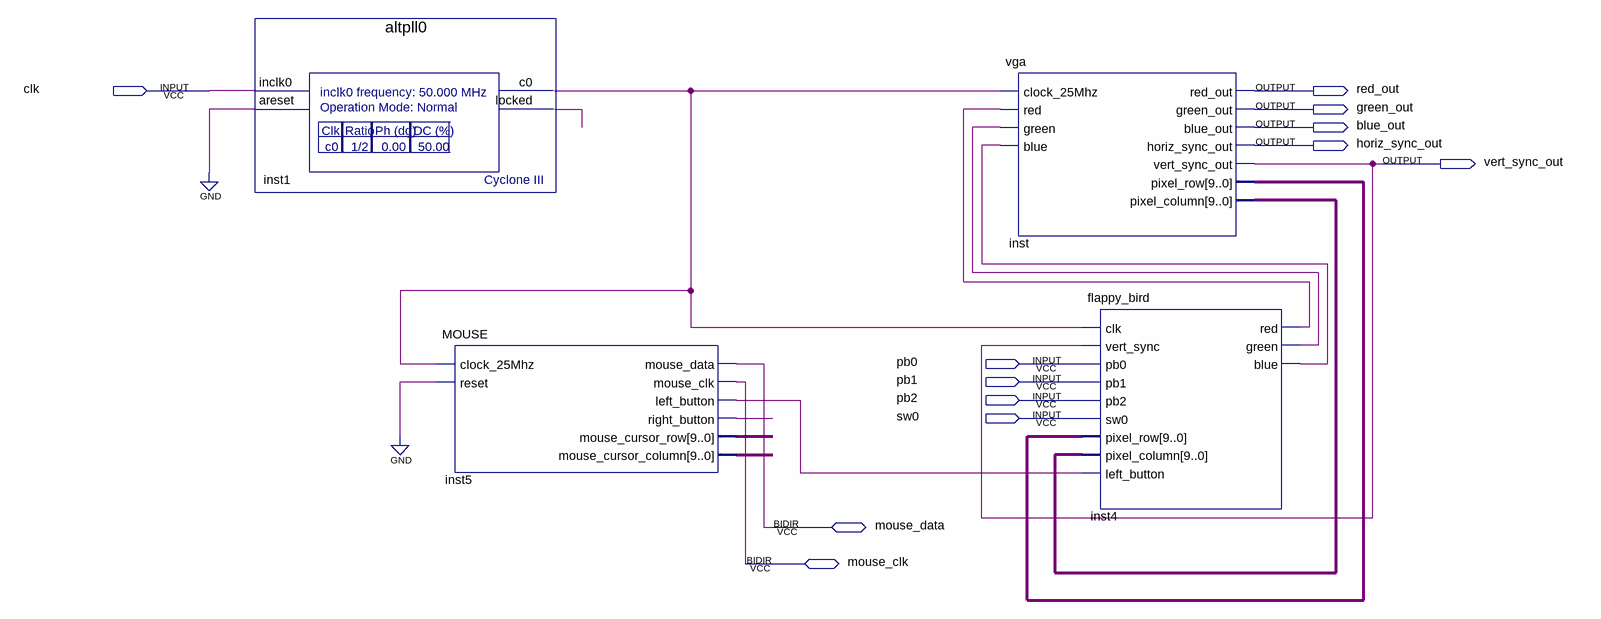
[diagram p0: schematic sheet]
// Quartus schematic vga_sync.bdf as structural Verilog: 4 symbols, 12 pins
module vga_sync (
  input  clk,
  input  pb0,
  input  pb1,
  input  pb2,
  input  sw0,
  inout  mouse_data,
  inout  mouse_clk,
  output red_out,
  output green_out,
  output blue_out,
  output horiz_sync_out,
  output vert_sync_out
);

  wire inst1_c0, inst1_locked, inst4_blue, inst4_green, inst4_red, inst5_left_button, inst5_right_button;
  wire [9:0] inst5_mouse_cursor_column, inst5_mouse_cursor_row, inst_pixel_column, inst_pixel_row;

  altpll0 inst1 (.inclk0(clk), .areset(1'b0), .c0(inst1_c0), .locked(inst1_locked));
  MOUSE inst5 (
    .clock_25Mhz(inst1_c0), .reset(1'b0), .left_button(inst5_left_button), .right_button(inst5_right_button),
    .mouse_cursor_row(inst5_mouse_cursor_row), .mouse_cursor_column(inst5_mouse_cursor_column),
    .mouse_data(mouse_data), .mouse_clk(mouse_clk));
  vga inst (
    .clock_25Mhz(inst1_c0), .red(inst4_red), .green(inst4_green), .blue(inst4_blue), .red_out(red_out),
    .green_out(green_out), .blue_out(blue_out), .horiz_sync_out(horiz_sync_out),
    .vert_sync_out(vert_sync_out), .pixel_row(inst_pixel_row), .pixel_column(inst_pixel_column));
  flappy_bird inst4 (
    .clk(inst1_c0), .vert_sync(vert_sync_out), .pb0(pb0), .pb1(pb1), .pb2(pb2), .sw0(sw0),
    .pixel_row(inst_pixel_row), .pixel_column(inst_pixel_column), .left_button(inst5_left_button),
    .red(inst4_red), .green(inst4_green), .blue(inst4_blue));
endmodule
